# EAGLE design Nixie HV PSU MAX1771 (EAGLE 9.3.0)
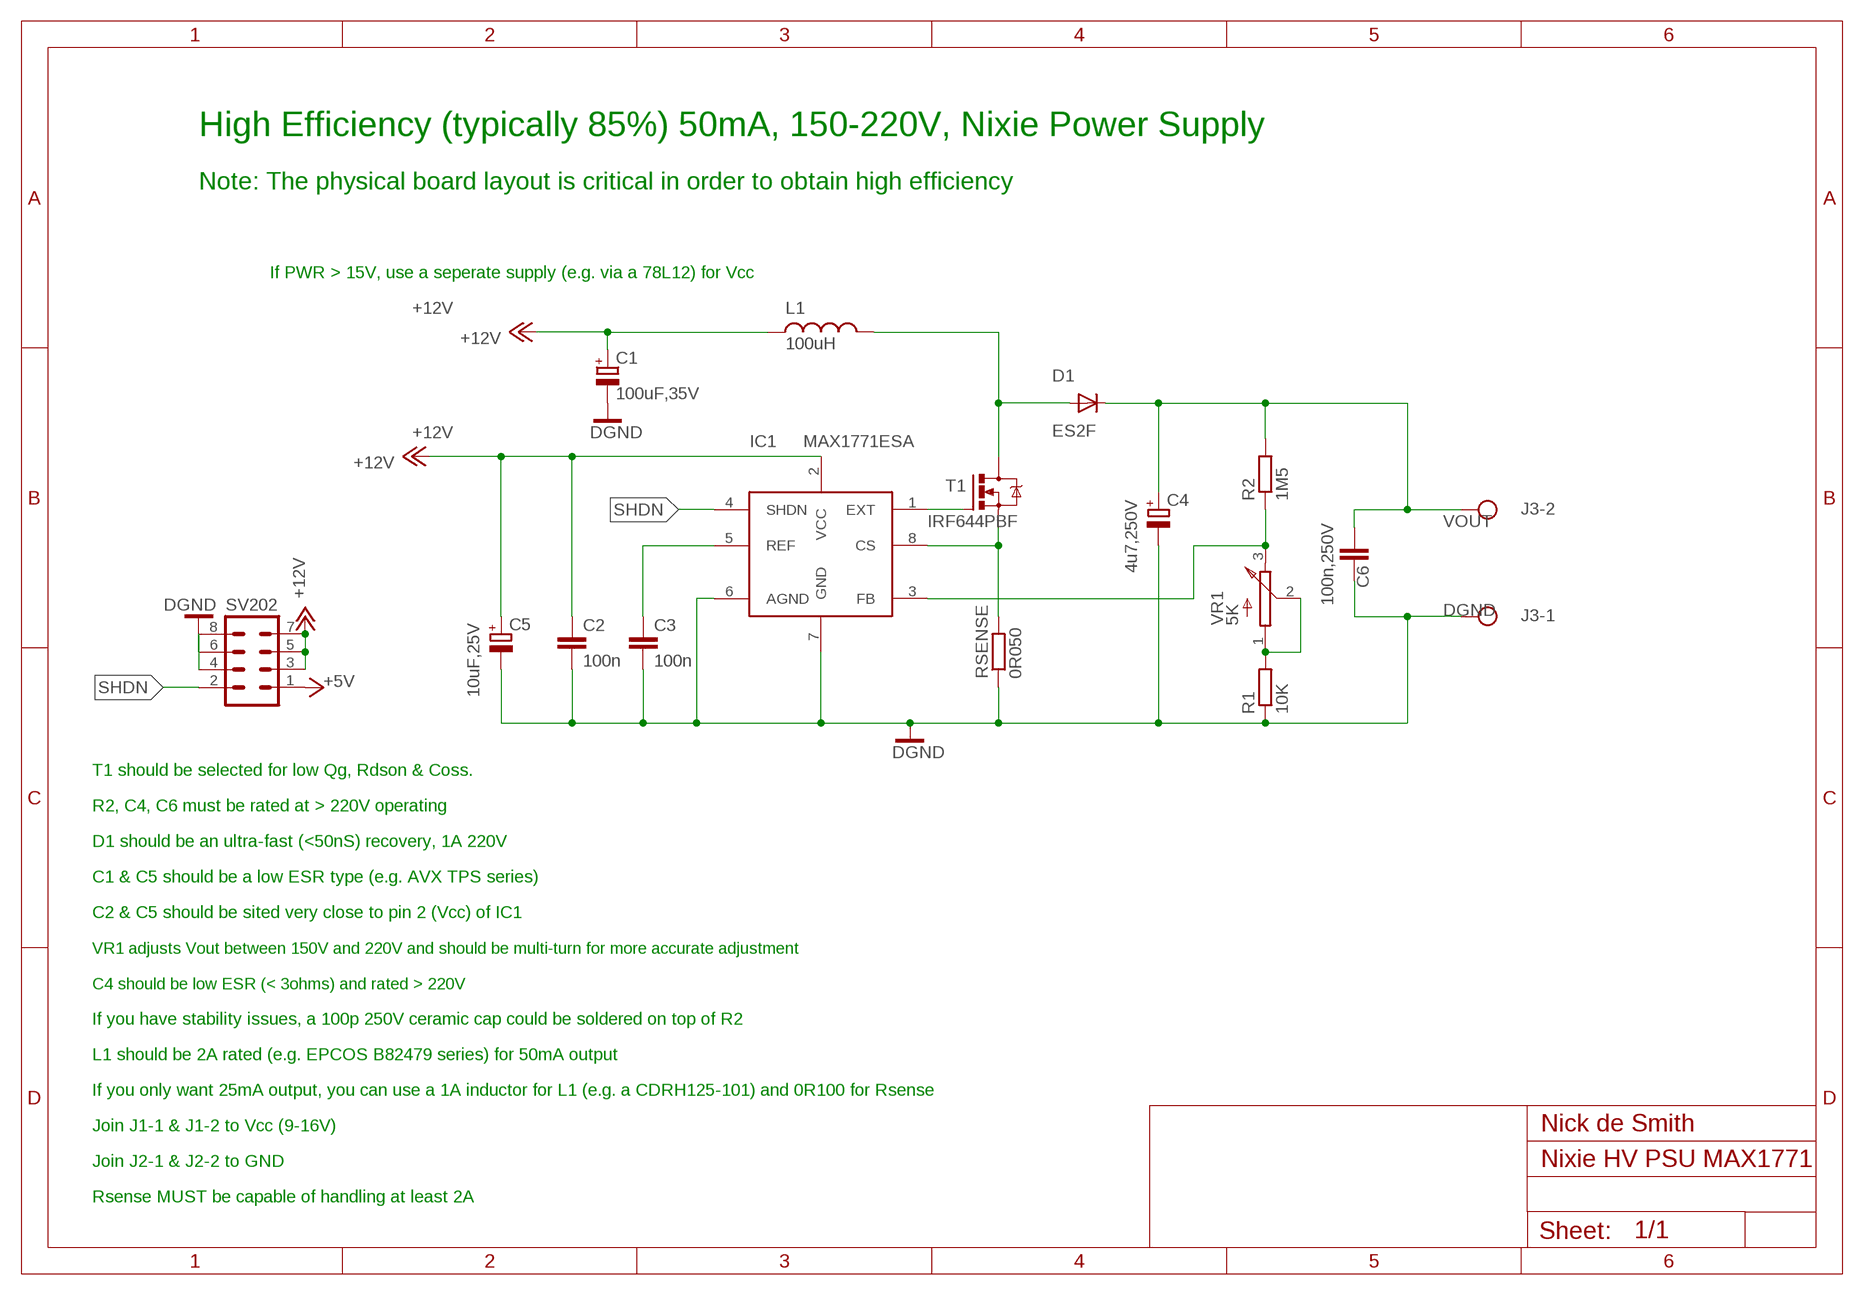
[diagram p0: schematic, sheet 1]

## Parts
C1  100uF,35V  C-POL-EU7343  [C-EIA-7343]
C2  100n  C-EUC0805  [C0805]
C3  100n  C-EUC0805  [C0805]
C4  4u7,250V  C-POL-EU-NICHICON-UJ-12  [NICHICON-UJ-12]
C5  10uF,25V  C-POL-EU7343  [C-EIA-7343]
C6  100n,250V  C-EU-2420  [C2420]
D1  ES2F  DIODE-SMC  [SMC]
IC1  MAX1771ESA  [SO-8]
J3  TERM-BLOCK-2-02IN  [SCREW-2-02]
L1  100uH  L-SMT-POWER-B82479  [L-B82479]
R1  10K  R-EU_R0805  [R0805]
R2  1M5  R-EU_R2512  [R2512]
RSENSE  0R050  R-EU_R2010  [R2010]
SV202  MA04-2  [MA04-2]
T1  IRF644PBF  IRF740  [TO220BV]
VR1  5K  TRIMPOT-3214W  [BOURNS-3214W]

## Nets
+5V: SV202.1
+12V: C1.+ C2.1 C5.+ IC1.2(VCC) L1.P$1 SV202.3 SV202.5 SV202.7
DGND [power]: C1.- C2.2 C3.2 C4.1(-) C5.- C6.P$2 IC1.6(AGND) IC1.7(GND) J3.1 R1.1 RSENSE.1 SV202.4 SV202.6 SV202.8
EXT: IC1.1(EXT) T1.G
N$2: IC1.8(CS) RSENSE.2 T1.S
N$3: R1.2 VR1.1(A) VR1.2(W)
N$8: IC1.3(FB) R2.1 VR1.3(B)
N$15 [power]: D1.A L1.P$2 T1.D
N$17: C3.1 IC1.5(REF)
SHDN: IC1.4(SHDN) SV202.2
VOUT [power]: C4.2(+) C6.P$1 D1.C J3.2 R2.2

## Notes on the sheet
- High Efficiency (typically 85%) 50mA, 150-220V, Nixie Power Supply
- Note: The physical board layout is critical in order to obtain high efficiency
- If PWR > 15V, use a seperate supply (e.g. via a 78L12) for Vcc
- T1 should be selected for low Qg, Rdson & Coss.
- R2, C4, C6 must be rated at > 220V operating
- D1 should be an ultra-fast (<50nS) recovery, 1A 220V
- C1 & C5 should be a low ESR type (e.g. AVX TPS series)
- C2 & C5 should be sited very close to pin 2 (Vcc) of IC1
- VR1 adjusts Vout between 150V and 220V and should be multi-turn for more accurate adjustment
- C4 should be low ESR (< 3ohms) and rated > 220V
- If you have stability issues, a 100p 250V ceramic cap could be soldered on top of R2
- L1 should be 2A rated (e.g. EPCOS B82479 series) for 50mA output
- If you only want 25mA output, you can use a 1A inductor for L1 (e.g. a CDRH125-101) and 0R100 for Rsense
- Join J1-1 & J1-2 to Vcc (9-16V) | Nick de Smith
- Join J2-1 & J2-2 to GND
- Rsense MUST be capable of handling at least 2A

## Library data of the parts
C1 = nick:C-POL-EU7343: Capacitor, Tantalum, EU 7343 case, polarised; MOUSER: 581-TPSD107M020R0085
C2 C3 = rcl:C-EU: CAPACITOR, European symbol; MOUSER: 80-C0805C104M4V
C4 = nick:C-POL-EU: Capacitor, Tantalum, EU 7343 case, polarised; MOUSER: 667-EEV-EB2E100Q
C5 = nick:C-POL-EU7343: Capacitor, Tantalum, EU 7343 case, polarised; MOUSER: 581-TPSD106K035R0300
C6 = nick:C-EU; MOUSER: 667-ECW-U2104KC9
D1 = diode:DIODE-: DIODE; MOUSER: 821-ES2FR5
IC1 = nick:MAX1771; MOUSER: 700-MAX1771ESAT
J3 = nick:TERM-BLOCK-2
L1 = nick:L-SMT-POWER: SMT power inductors; MOUSER: 871-B82479A1104M
R1 = rcl:R-EU_: RESISTOR, European symbol; MOUSER: 71-CRCW080510K0FKEAC
R2 = rcl:R-EU_: RESISTOR, European symbol; MOUSER: 279-35221M5JT
RSENSE = rcl:R-EU_: RESISTOR, European symbol; MOUSER: 66-LR2010LF-01-R050
SV202 = con-lstb:MA04-2: PIN HEADER; OC_FARNELL: unknown; OC_NEWARK: unknown
T1 = transistor-power:IRF740: N-CHANNEL MOS FET; MOUSER: 844-IRF644PBF
VR1 = nick:TRIMPOT; MOUSER: 652-3214W-1-502E

## Net classes
1 power: width 0.762 mm, clearance 0.508 mm

## Board
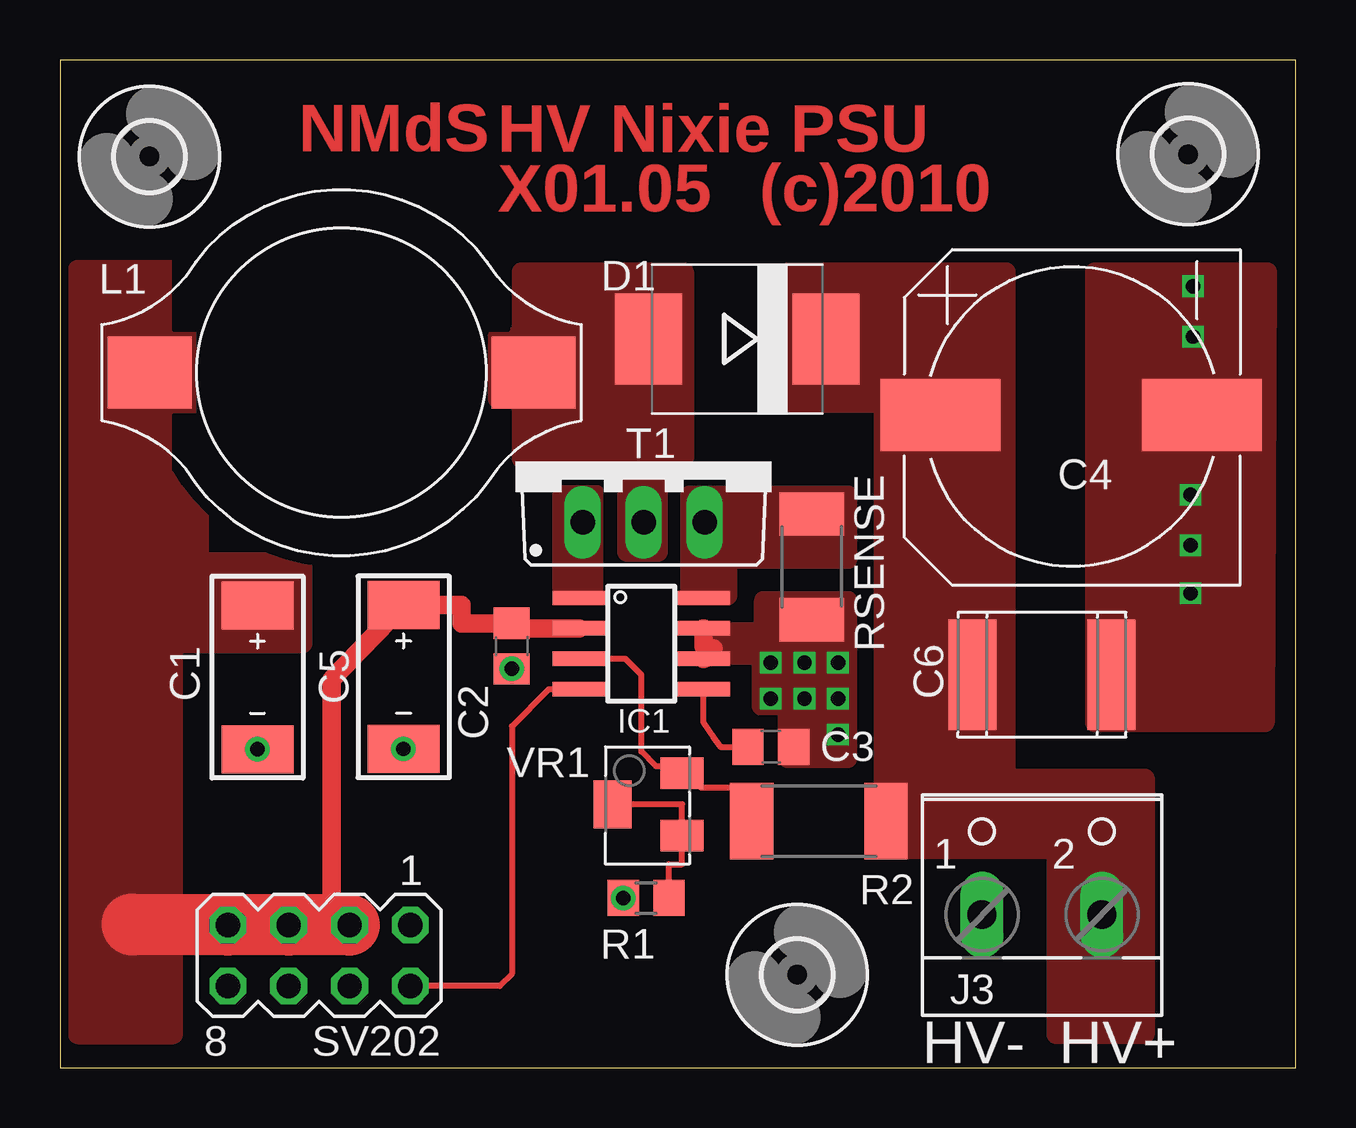
[diagram p1: board, top side]
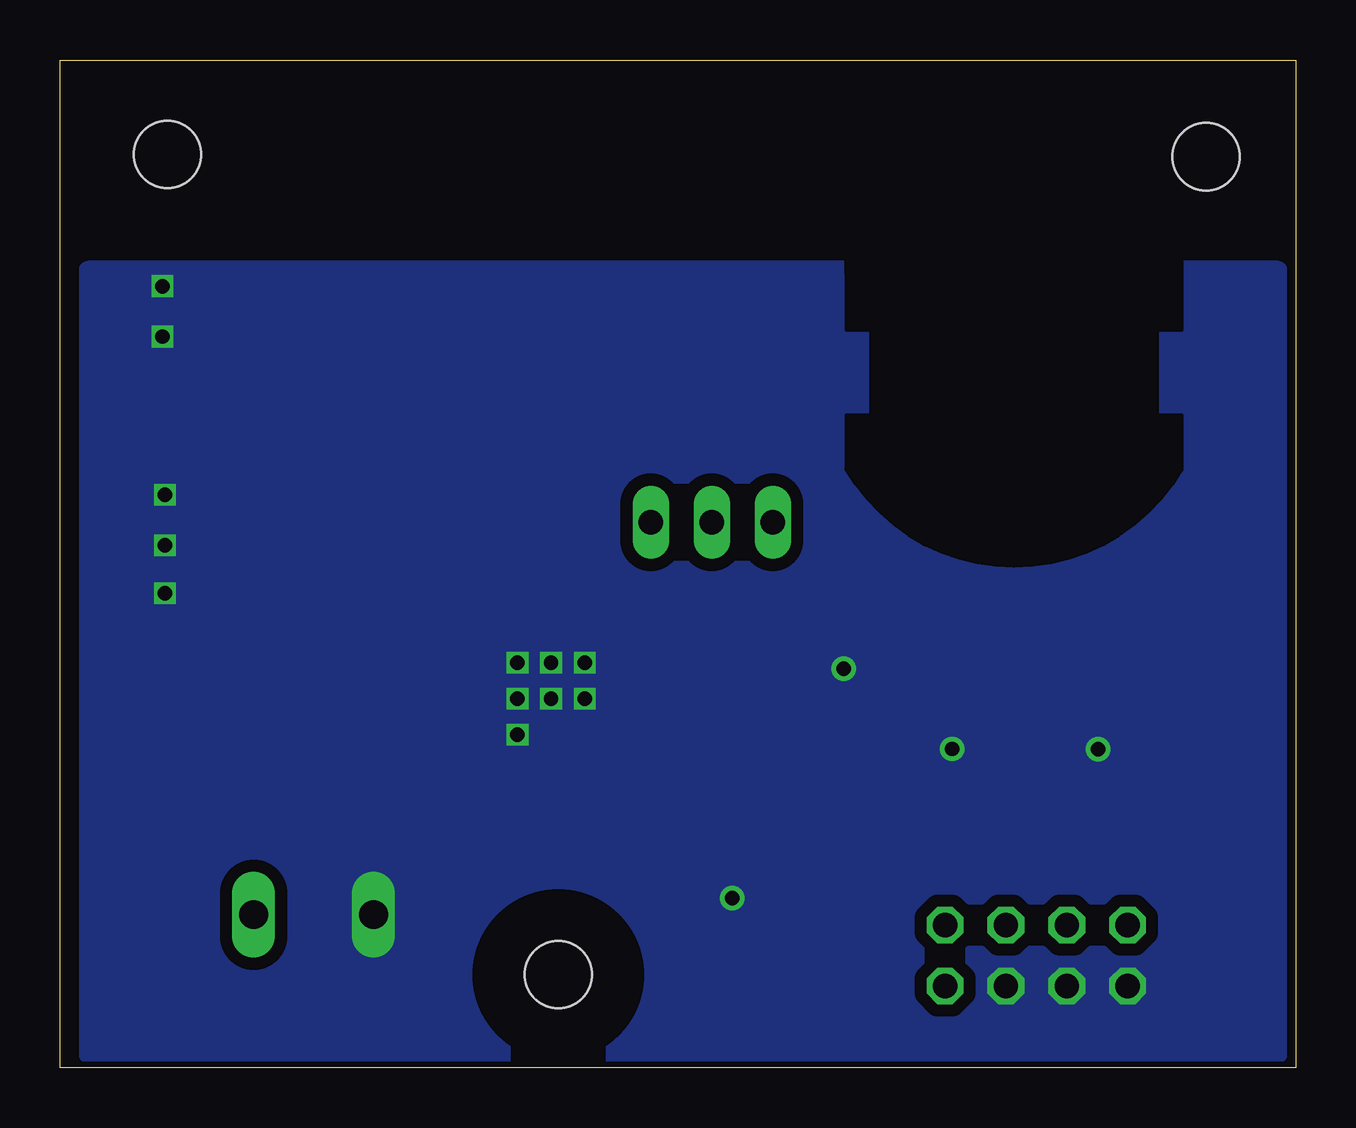
[diagram p2: board, bottom side, seen from below]

Size 51.5 x 42 mm. Coordinates in mm from the lower left corner, seen from the top.
Outline: 0,0 51.5,0 51.5,42 0,42 0,0
Copper layers (1*16): Top 0.035mm / dielectric 1.5mm / Bottom 0.035mm
Design rules "dirt_cheap_dirty_boards.v1.1": minimum track width 6mil, minimum drill 12mil, track to track 6mil, track to pad 6mil, pad to pad 6mil, via to via 6mil, smd to smd 0mil, copper to edge 10mil, drill to drill 10mil, minimum pad ring 10mil, minimum via ring 6mil, stop-mask expansion 2mil, vias tented up to drill 25mil, thermal gap 10mil

### Footprints (pad centres in the part's own frame; a part is rotated, then mirrored left to right if it is on the bottom)
C-EIA-7343 = smd 2 x 3: + -3,0; - 3,0
C0805 = smd 1.3 x 1.5: 1 -0.95,0; 2 0.95,0
NICHICON-UJ-12 = smd 3 x 5: 1 -2.4,-7.6; 2 -2.4,3.3
C2420 = smd 2 x 4.6: P$1 2.9,0; P$2 -2.9,0
SMC = smd 2.8 x 3.8: A 3.7,0; C -3.7,0
SO-8 = smd 0.6 x 2.2: 1 -1.905,-2.6; 2 -0.635,-2.6; 3 0.635,-2.6; 4 1.905,-2.6; 5 1.905,2.6; 6 0.635,2.6; 7 -0.635,2.6; 8 -1.905,2.6
SCREW-2-02 = drill 1.194 long: 1 -2.5,0; 2 2.5,0
L-B82479 = smd 3.5 x 3: P$1 -8,0; P$2 8,0
R0805 = smd 1.3 x 1.5: 1 -0.95,0; 2 0.95,0
R2512 = smd 1.8 x 3.2: 1 -2.8,0; 2 2.8,0
R2010 = smd 1.8 x 2.7: 1 -2.2,0; 2 2.2,0
MA04-2 = drill 1.016 octagon: 1 -3.81,-1.27; 2 -3.81,1.27; 3 -1.27,-1.27; 4 -1.27,1.27; 5 1.27,-1.27; 6 1.27,1.27; 7 3.81,-1.27; 8 3.81,1.27
TO220BV = drill 1.016 long: D 0,-2.54; G -2.54,-2.54; S 2.54,-2.54
2,8 = hole 2.8: 0,0
BOURNS-3214W = smd 1.8 x 1.3: 1 1.4,-1.3; 3 1.4,1.3 | smd 1.6 x 2: 2 -1.5,0

### Placement (x,y rotation side)
C1  8.23,16.27 270 top
C2  18.83,17.57 270 top
C3  29.63,13.37 0 top
C4  39.99,29.6 90 top
C5  14.32,16.28 270 top
C6  40.93,16.37 180 top
D1  28.23,30.37 180 top
IC1  24.23,17.67 270 top
J3  40.93,6.37 0 top
L1  11.73,28.97 0 top
R1  24.43,7.07 0 top
R2  31.63,10.27 0 top
RSENSE  31.33,20.87 90 top
SV202  10.8,4.67 180 top
T1  24.33,25.27 0 top
U$2  [2,8]  3.73,37.97 0 top
U$3  [2,8]  47.02,38.07 0 top
U$4  [2,8]  30.73,3.87 0 top
VR1  24.53,10.97 0 top

### Tracks (layer width: path | path; a pad name or v marks a point on that pad's centre or on a via)
+12V
  Top 0.762: IC1.2 18.83,18.3 C2.1 16.73,18.52 16.73,19.28 C5.+ 11.33,16.18 11.33,6.68 SV202.3
  Top 2.54: SV202.3 SV202.5 SV202.7 3.03,5.94 2.99,5.97
  pour Top (isolate 0.01, rank 2, no thermals): 4.73,17.67 10.13,17.67 10.13,21.07 5.83,21.07 5.83,33.27 0.73,33.27 0.73,1.37 4.73,1.37
DGND  (via drill 0.6, 0.6 pad 1.02)
  Top 0.762: IC1.6 26.93,17.07 27.23,17.17 | 27.23,17.47 26.93,17.47 26.83,17.57 IC1.7
  other vias: 29.63,16.87 31.03,15.37 32.43,13.87 32.43,15.37 32.43,16.87 31.03,16.87 29.63,15.37 47.13,23.87 47.13,21.77 47.13,19.77 23.48,7.07 14.32,13.28 8.23,13.27 18.83,16.62 47.23,30.47 47.23,32.57
  pour Bottom (isolate 0.01, rank 3, no thermals): 0.73,33.23 50.33,33.23 50.33,0.57 0.73,0.57
  pour Top (no thermals): 27.23,17.17 27.23,18.17 29.33,18.17 29.33,19.47 32.83,19.47 32.83,12.87 30.33,12.87 30.33,15.07 29.23,15.07 29.23,17.17
  pour Top (rank 2, no thermals): 43.13,33.17 50.33,33.17 50.23,14.37 43.13,14.37
EXT
  pour Top (no thermals): 20.73,24.07 22.43,24.07 22.43,19.47 20.73,19.47
N$2
  pour Top (no thermals): 26.26,19.67 26.26,23.87 32.83,23.87 32.83,21.17 27.83,21.17 27.83,19.67
N$3
  Top 0.254: VR1.2 25.93,10.97 VR1.1 25.93,8.47 25.38,8.47 R1.2
N$8
  Top 0.254: IC1.3 23.57,17.04 24.23,16.37 24.23,13.17 24.83,12.57 25.93,12.57 VR1.3 26.73,11.67 28.03,11.67 R2.1
N$15
  pour Top (rank 2, no thermals): 19.23,30.47 19.23,33.17 26.03,33.17 26.03,25.37 24.93,25.37 24.93,21.47 23.63,21.47 23.63,25.37 19.23,25.37 19.23,27.87 18.23,27.87 18.23,30.47
N$17
  Top 0.254: C3.1 27.53,13.37 27.23,13.77 26.83,14.37 IC1.5
SHDN
  Top 0.254: IC1.4 20.37,15.77 18.84,14.23 18.84,3.9 18.33,3.4 SV202.2
VOUT
  pour Top (isolate 0.01, rank 2, no thermals): 30.33,33.17 39.43,33.17 39.43,12.07 45.23,12.07 45.23,1.37 41.53,1.37 41.53,9.07 34.33,9.07 34.33,27.67 30.33,27.67

### Text on the board
Top: NMdS | HV Nixie PSU | X01.05 | (c)2010
tPlace: HV- | HV+
Measures: 0.000 | 0.146 | 1.839 | 1.655 | 1.512 | 1.508 | 0.154 | 0.000 | 0.000 | 0.001 | 0.000 | 0.001 | 0.000 | 0.000 | 1.209 | 2.026